# Altium schematic sheet 基本外设.SchDoc
size A4
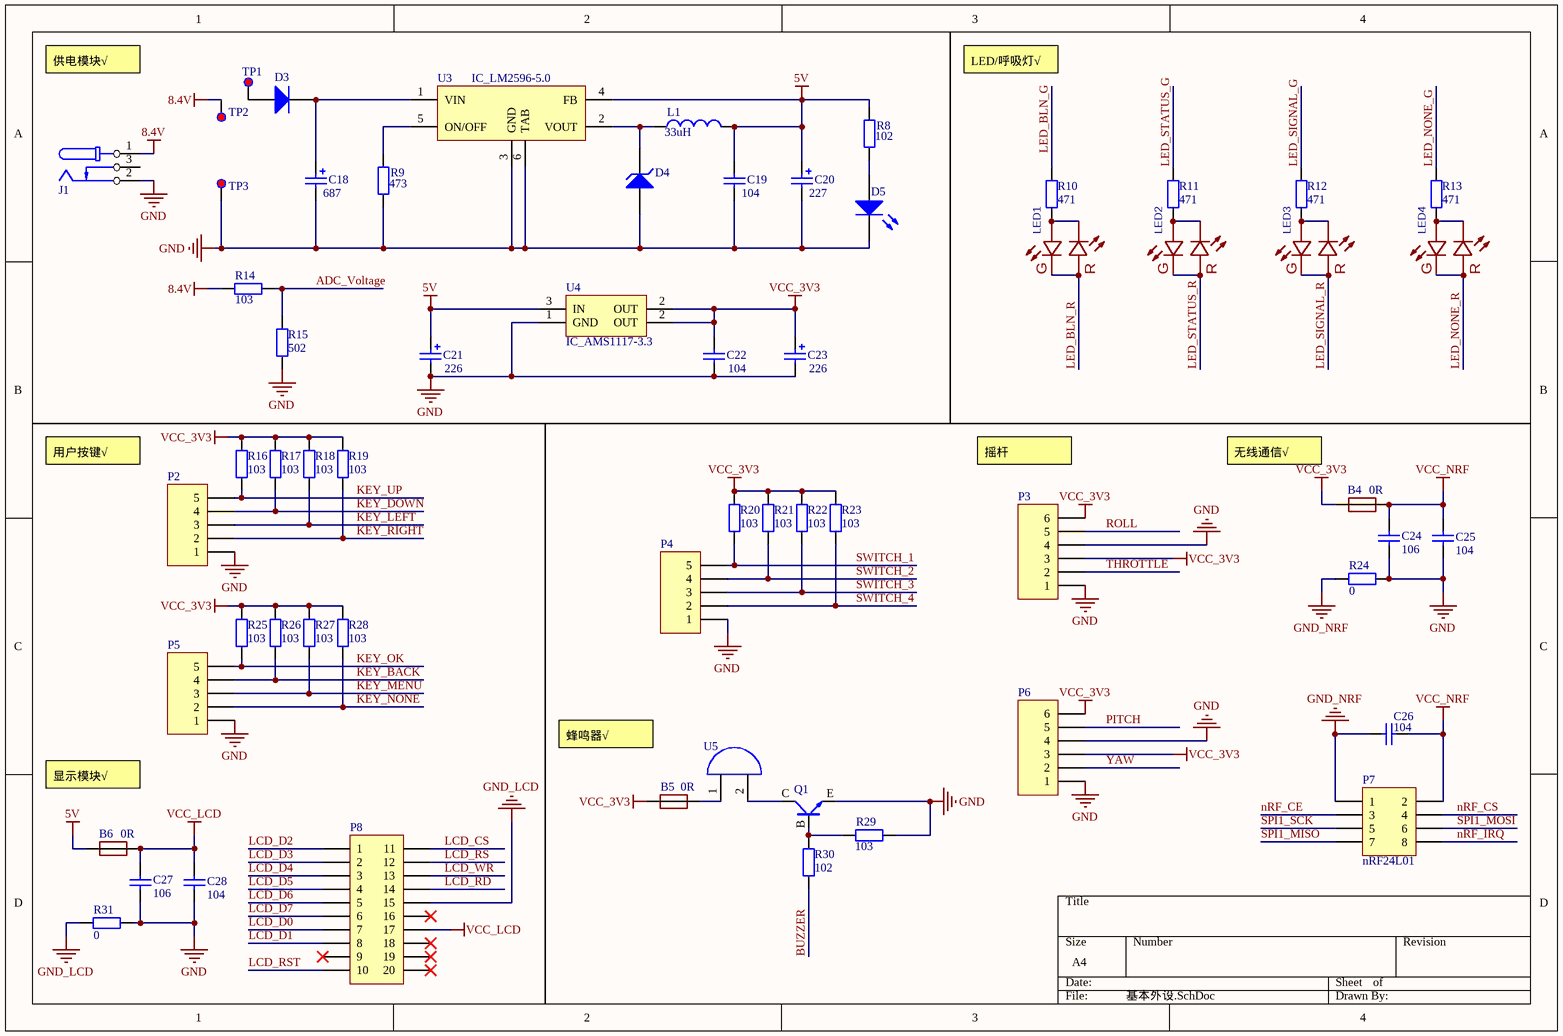
[diagram p0: 基本外设.SchDoc]

## Parts
B4  value 0R  [CC1608-0603]  (hidden comment: MPZ1608S101ATDH5)
B5  value 0R  [CC1608-0603]  (hidden comment: MPZ1608S101ATDH5)
B6  value 0R  [CC1608-0603]  (hidden comment: MPZ1608S101ATDH5)
C18  value 687  [CDT-10]  (hidden comment: Cap Pol2)
C19  value 104  [CC1608-0603]  (hidden comment: Cap)
C20  value 227  [CDT-6.3]  (hidden comment: Cap Pol2)
C21  value 226  [CDT-5]  (hidden comment: Cap Pol2)
C22  value 104  [CC1608-0603]  (hidden comment: Cap)
C23  value 226  [CDT-5]  (hidden comment: Cap Pol2)
C24  value 106  [CC1608-0603]  (hidden comment: Cap)
C25  value 104  [CC1608-0603]  (hidden comment: Cap)
C26  value 104  [CC1608-0603]  (hidden comment: Cap)
C27  value 106  [CC1608-0603]  (hidden comment: Cap)
C28  value 104  [CC1608-0603]  (hidden comment: Cap)
D3  Diode  [DO-214AC(SMA)-D]  (value not drawn)
D4  D Zener  [DO-214AC(SMA)-T]  (value not drawn)
D5  LED0  [CD1608-0603]  (value not drawn)
J1  PT_POWERJACK  [DC2.2]  (value not drawn)
L1  value 33uH  [L7.3X7.3X4.5]  (hidden comment: Inductor)
LED1  DX_LED_无极  [LED_无极]  (value not drawn)
LED2  DX_LED_无极  [LED_无极]  (value not drawn)
LED3  DX_LED_无极  [LED_无极]  (value not drawn)
LED4  DX_LED_无极  [LED_无极]  (value not drawn)
P2  Header 5  [XHT_1.25_SMD_5p]  (value not drawn)
P3  Header 6  [XHT_2.0_SMD_6P]  (value not drawn)
P4  Header 6  [XHT_1.25_SMD_5p]  (value not drawn)
P5  Header 5  [XHT_1.25_SMD_5p]  (value not drawn)
P6  Header 6  [XHT_2.0_SMD_6P]  (value not drawn)
P7  nRF24L01  [HDR2X4]
P8  Header 10X2A  [LCD_2.4_TFT]  (value not drawn)
Q1  TX_NPN  [SOT-23-3T]  (value not drawn)
R8  value 102  [CC1608-0603]  (hidden comment: Res2)
R9  value 473  [CC1608-0603]  (hidden comment: Res2)
R10  value 471  [CC1608-0603]  (hidden comment: RX_RES)
R11  value 471  [CC1608-0603]  (hidden comment: RX_RES)
R12  value 471  [CC1608-0603]  (hidden comment: RX_RES)
R13  value 471  [CC1608-0603]  (hidden comment: RX_RES)
R14  value 103  [CC1608-0603]  (hidden comment: Res2)
R15  value 502  [CC1608-0603]  (hidden comment: Res2)
R16  value 103  [CC1608-0603]  (hidden comment: RX_RES)
R17  value 103  [CC1608-0603]  (hidden comment: RX_RES)
R18  value 103  [CC1608-0603]  (hidden comment: RX_RES)
R19  value 103  [CC1608-0603]  (hidden comment: RX_RES)
R20  value 103  [CC1608-0603]  (hidden comment: RX_RES)
R21  value 103  [CC1608-0603]  (hidden comment: RX_RES)
R22  value 103  [CC1608-0603]  (hidden comment: RX_RES)
R23  value 103  [CC1608-0603]  (hidden comment: RX_RES)
R24  value 0  [CC1608-0603]  (hidden comment: RX_RES)
R25  value 103  [CC1608-0603]  (hidden comment: RX_RES)
R26  value 103  [CC1608-0603]  (hidden comment: RX_RES)
R27  value 103  [CC1608-0603]  (hidden comment: RX_RES)
R28  value 103  [CC1608-0603]  (hidden comment: RX_RES)
R29  value 103  [CC1608-0603]  (hidden comment: RX_RES)
R30  value 102  [CC1608-0603]  (hidden comment: RX_RES)
R31  value 0  [CC1608-0603]  (hidden comment: RX_RES)
TP1  PT_TESTPOINT  [TP-SMD]  (value not drawn)
TP2  PT_TESTPOINT  [TP-SMD]  (value not drawn)
TP3  PT_TESTPOINT  [TP-SMD]  (value not drawn)
U3  IC_LM2596-5.0  [TO-263-5]
U4  IC_AMS1117-3.3  [SOT-223]
U5  SC_BEEP  [SC_Buzzer]  (value not drawn)

## Nets
5V: B6.1 C19.2 C20.1 C21.1 L1.2 R8.2 U3.4(FB) U4.3(IN)
8.4V: J1.1 R14.2 TP2.1
GND: C18.2 C19.1 C20.2 C21.2 C22.1 C23.2 C24.1 C25.1 C27.1 C28.1 D4.1(A) D5.2(K) J1.2 P2.1 P3.1 P3.4 P4.1 P5.1 P6.1 P6.4 Q1.E R9.1 R15.2 R24.2 R29.1 R31.2 TP3.1 U3.3(GND) U3.6(TAB) U4.1(GND)
GND_LCD: P8.15 R31.1
GND_NRF: C26.2 P7.1 R24.1
VCC_3V3: B4.1 B5.2 C22.2 C23.1 P3.3 P3.6 P6.3 P6.6 R16.1 R17.1 R18.1 R19.1 R20.1 R21.1 R22.1 R23.1 R25.1 R26.1 R27.1 R28.1 U4.2(OUT)
VCC_LCD: B6.2 C27.2 C28.2 P8.17
VCC_NRF: B4.2 C24.2 C25.2 C26.1 P7.2
ADC_Voltage: R14.1 R15.1
BUZZER: R30.1
KEY_BACK: P5.4 R26.2
KEY_DOWN: P2.4 R17.2
KEY_LEFT: P2.3 R18.2
KEY_MENU: P5.3 R27.2
KEY_NONE: P5.2 R28.2
KEY_OK: P5.5 R25.2
KEY_RIGHT: P2.2 R19.2
KEY_UP: P2.5 R16.2
LCD_CS: P8.11
LCD_D0: P8.7
LCD_D1: P8.8
LCD_D2: P8.1
LCD_D3: P8.2
LCD_D4: P8.3
LCD_D5: P8.4
LCD_D6: P8.5
LCD_D7: P8.6
LCD_RD: P8.14
LCD_RS: P8.12
LCD_RST: P8.10
LCD_WR: P8.13
LED_BLN_G: R10.2
LED_BLN_R: LED1.1(-)
LED_NONE_G: R13.2
LED_NONE_R: LED4.1(-)
LED_SIGNAL_G: R12.2
LED_SIGNAL_R: LED3.1(-)
LED_STATUS_G: R11.2
LED_STATUS_R: LED2.1(-)
nRF_CE: P7.3
nRF_CS: P7.4
nRF_IRQ: P7.8
PITCH: P6.5
ROLL: P3.5
SPI1_MISO: P7.7
SPI1_MOSI: P7.6
SPI1_SCK: P7.5
SWITCH_1: P4.5 R20.2
SWITCH_2: P4.4 R21.2
SWITCH_3: P4.3 R22.2
SWITCH_4: P4.2 R23.2
THROTTLE: P3.2
YAW: P6.2
NetB5_1: B5.1 U5.1
NetC18_1: C18.1 D3.2(K) U3.1(VIN)
NetD3_1: D3.1(A) TP1.1
NetD4_2: D4.2(K) L1.1 U3.2(VOUT)
NetD5_1: D5.1(A) R8.1
NetLED1_2: LED1.2(+) R10.1
NetLED2_2: LED2.2(+) R11.1
NetLED3_2: LED3.2(+) R12.1
NetLED4_2: LED4.2(+) R13.1
NetQ1_B: Q1.B R29.2 R30.2
NetQ1_C: Q1.C U5.2
NetR9_2: R9.2 U3.5(ON/OFF)

Not connected (* = marked no-connect by the designer): J1 3; P8 9* 16* 18* 19* 20*

## Notes on the sheet
- 供电模块√
- LED/呼吸灯√
- 用户按键√
- 摇杆
- (near B4) 无线通信√
- 显示模块√
- 蜂鸣器√
- (in symbol DX_LED_无极) G; R

## Library data of the parts
B4-B6 = FB_BEAD: 磁珠
C18 C20 C21 C23 = Cap Pol2: Polarized Capacitor (Axial); Published: 8-Jun-2000; LatestRevisionDate: 17-Jul-2002; LatestRevisionNote: Re-released for DXP Platform.; PackageReference: POLAR0.8; Publisher: Altium Limited; PackageDescription: Polarized Capacitor; 2 Leads
C19 C22 C24-C28 = Cap: Capacitor; Published: 8-Jun-2000; LatestRevisionDate: 17-Jul-2002; LatestRevisionNote: Re-released for DXP Platform.; PackageReference: RAD-0.3; Publisher: Altium Limited; PackageDescription: Radial Cap, Thru-Hole; 2 Leads; 0.3 in Pin Spacing
D3 = Diode: Default Diode; Published: 8-Jun-2000; LatestRevisionDate: 17-Jul-2002; LatestRevisionNote: Re-released for DXP Platform.; PackageVersion: Sep-1996; PackageReference: SMC; Publisher: Altium Limited; PackageDescription: DO-214-AB/SMC; 2 C-Bend Leads; Body 7.9 x 5.9 mm, inc. leads (LxW); Code_JEDEC: DO-214-AB
D4 = D Zener: Zener Diode; Published: 8-Jun-2000; LatestRevisionDate: 17-Jul-2002; LatestRevisionNote: Re-released for DXP Platform.; PackageReference: DIODE-0.7; Publisher: Altium Limited; PackageDescription: Diode, Thru-Hole; 2 Leads; 0.7 in Pin Spacing
D5 = LED0: Typical INFRARED GaAs LED; Published: 8-Jun-2000; LatestRevisionDate: 08-Jul-2005; LatestRevisionNote: Mech Layer 1 removed.; PackageReference: LED-0; Publisher: Altium Limited; PackageDescription: LED; 2 Leads
J1 = PT_POWERJACK: DC端子
L1 = Inductor: Code_IEC: 1005; Published: 8-Jun-2000; LatestRevisionDate: 29-May-2009; LatestRevisionNote: IPC-7351 Footprint Added.; PackageReference: 0402-A; Publisher: Altium Limited; PackageDescription: Chip Inductor; Code_JEITA: 0402
LED1-LED4 = DX_LED_无极: 无极双色发光二极管; BOM_Manufacturer: TOGIALED; BOM_Manufacturer Part: TJ-L5FYTXHMNPLC2R7K-A5; Contributor: LCSC; BOM_Supplier: LCSC; BOM_Supplier Part: C440436; spicePre: L; spiceSymbolName: TJ-L5FYTXHMNPLC2R7K-A5
P2 P4 P5 = Header 5: Header, 5-Pin; LatestRevisionDate: 17-Jul-2002; LatestRevisionNote: Re-released for DXP Platform.; Publisher: Altium Limited
P3 P6 = Header 6: Header, 6-Pin; LatestRevisionDate: 17-Jul-2002; LatestRevisionNote: Re-released for DXP Platform.; Publisher: Altium Limited
P7 = Header 4X2: Header, 4-Pin, Dual row; LatestRevisionDate: 17-Jul-2002; LatestRevisionNote: Re-released for DXP Platform.; Publisher: Altium Limited
P8 = Header 10X2A: Header, 10-Pin, Dual row; LatestRevisionDate: 17-Jul-2002; LatestRevisionNote: Re-released for DXP Platform.; Publisher: Altium Limited
Q1 = TX_NPN: NPN三极管
R8 R9 R14 R15 = Res2: Resistor; Published: 8-Jun-2000; LatestRevisionDate: 17-Jul-2002; LatestRevisionNote: Re-released for DXP Platform.; PackageReference: AXIAL-0.4; Publisher: Altium Limited; PackageDescription: Axial Device, Thru-Hole; 2 Leads; 0.4 in Pin Spacing
R10-R13 R16-R31 = RX_RES: 电阻
TP1-TP3 = PT_TESTPOINT: 测试点
U3 = IC_LM2596: 电源芯片
U4 = IC_AMS1117: 电源芯片
U5 = SC_BEEP: 蜂鸣器